# EAGLE design blink1mk3_005t6_3535_4l_usbc (EAGLE 9.5.2)
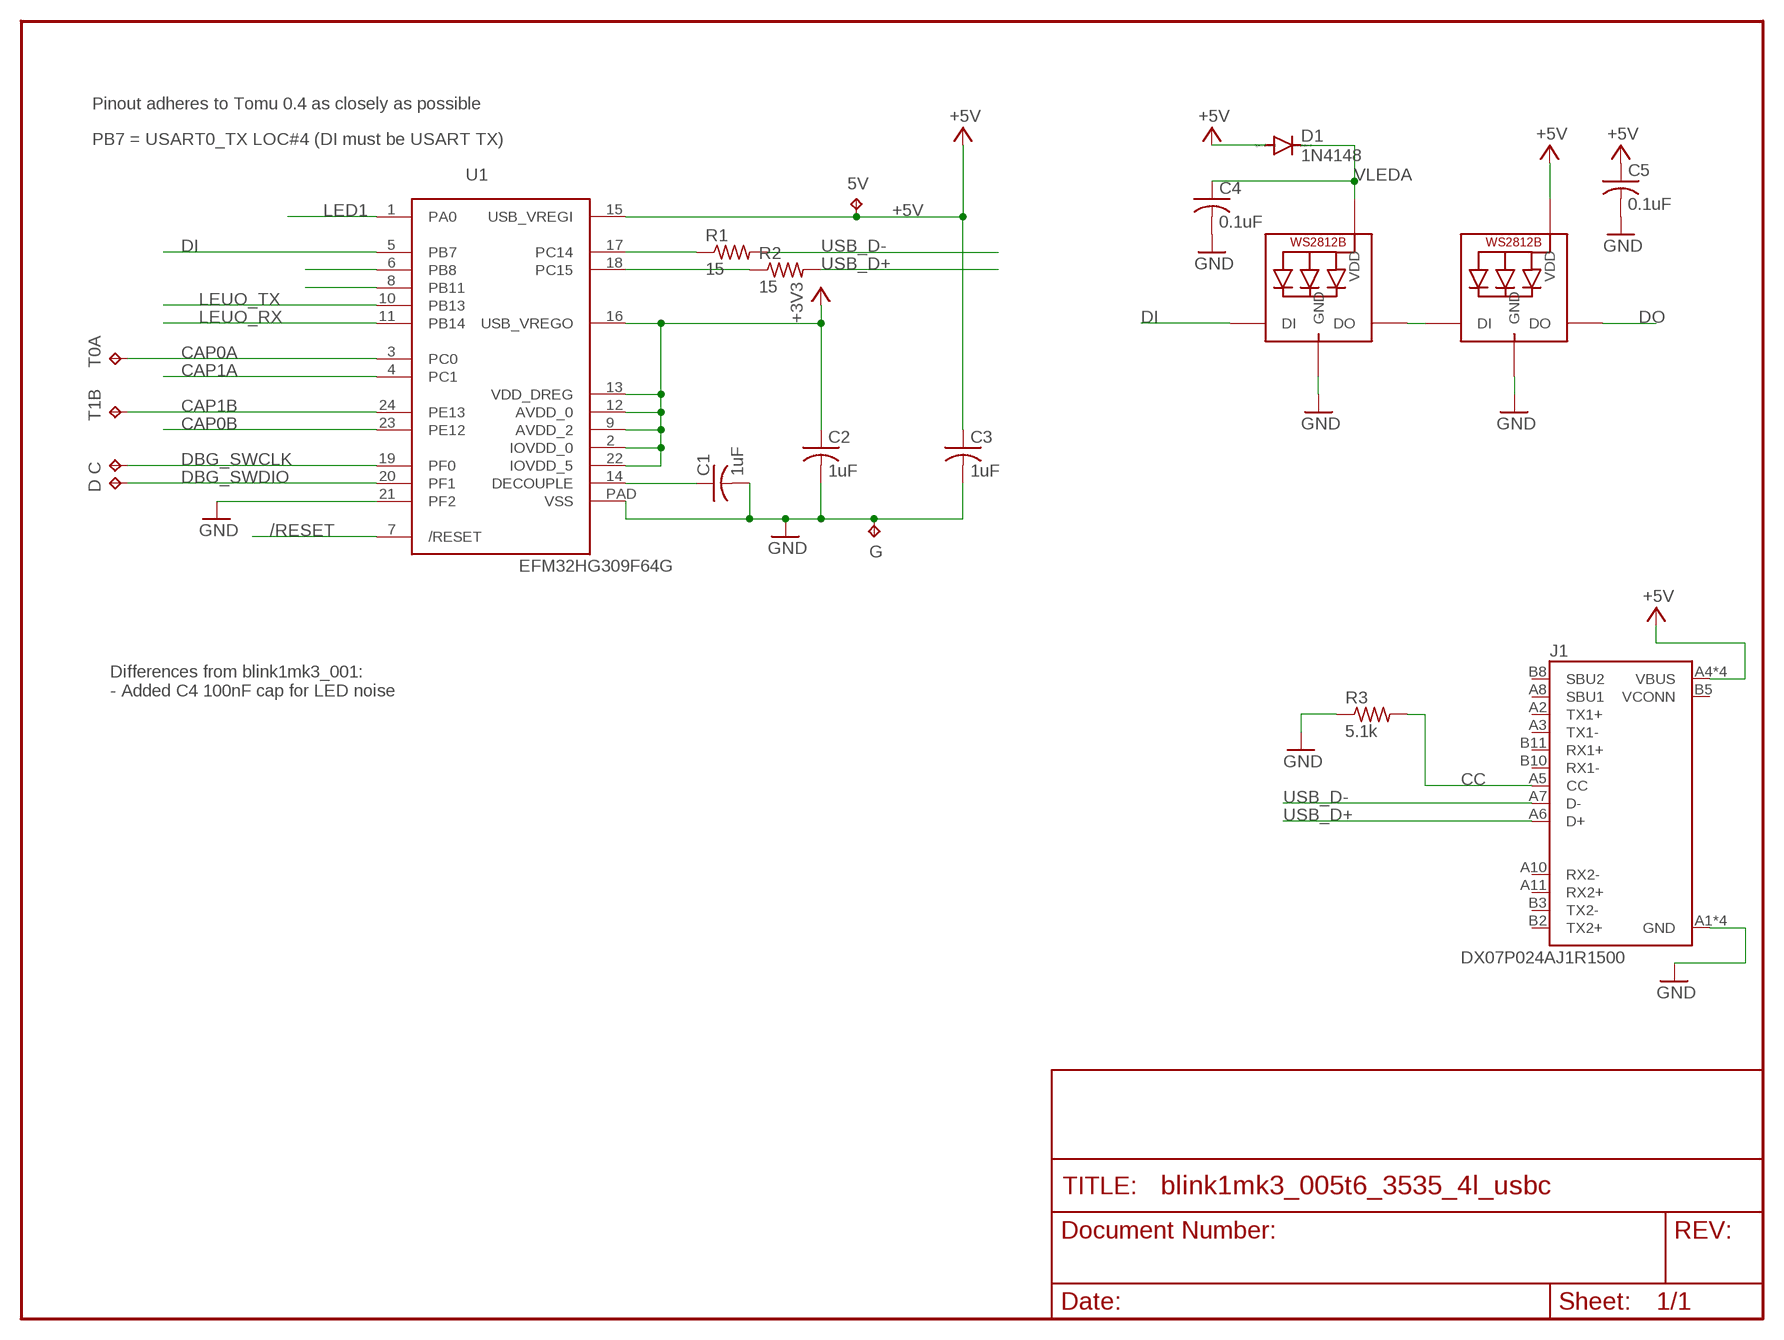
[diagram p0: schematic, sheet 1]

## Parts
5V  TPTP10R  [TP10R]
C  TPTP10R  [TP10R]
C1  1uF  C-USC0402  [C0402]
C2  1uF  C-USC0402  [C0402]
C3  1uF  C-USC0402  [C0402]
C4  0.1uF  C-USC0402  [C0402]
C5  0.1uF  C-USC0402  [C0402]
D  TPTP10R  [TP10R]
D1  1N4148  DIODE-SOD523  [SOD523]
G  TPTP10R  [TP10R]
J1  DX07P024AJ1R1500  [JAE_DX07P024AJ1R1500]
LED1  WS2812B3535  [LED3535]
LED2  SK6812MINI  WS2812B3535  [LED3535]
R1  15  R-US_R0402  [R0402]
R2  15  R-US_R0402  [R0402]
R3  5.1k  R-US_R0402  [R0402]
T0A  TPTP15R  [TP15R]
T1B  TPTP15R  [TP15R]
U1  EFM32HG309F64G  [QFN24PAD]

## Nets
+3V3: C2.1 U1.2(IOVDD_0) U1.9(AVDD_2) U1.12(AVDD_0) U1.13(VDD_DREG) U1.16(USB_VREGO) U1.22(IOVDD_5)
+5V: 5V.TP C3.1 C5.1 D1.A J1.A4(VBUS) J1.A9(VBUS) J1.B4(VBUS) J1.B9(VBUS) LED2.2(VDD) U1.15(USB_VREGI)
/RESET: U1.7(/RESET)
CAP0A: T0A.TP U1.3(PC0)
CAP0B: U1.23(PE12)
CAP1A: U1.4(PC1)
CAP1B: T1B.TP U1.24(PE13)
CC: J1.A5(CC) R3.2
DBG_SWCLK: C.TP U1.19(PF0)
DBG_SWDIO: D.TP U1.20(PF1)
DECOUPLE: C1.1 U1.14(DECOUPLE)
DI: LED1.1(DI) U1.5(PB7)
DO: LED2.3(DO)
GND: C1.2 C2.2 C3.2 C4.2 C5.2 G.TP J1.A1(GND) J1.A12(GND) J1.B1(GND) J1.B12(GND) LED1.4(GND) LED2.4(GND) R3.1 U1.21(PF2) U1.PAD(VSS)
LED1: U1.1(PA0)
LEUO_RX: U1.11(PB14)
LEUO_TX: U1.10(PB13)
N$1: U1.8(PB11)
N$2: LED1.3(DO) LED2.1(DI)
N$3: U1.6(PB8)
RUSB_D+: R2.1 U1.18(PC15)
RUSB_D-: R1.1 U1.17(PC14)
USB_D+: J1.A6(D+) R2.2
USB_D-: J1.A7(D-) R1.2
VLEDA: C4.1 D1.C LED1.2(VDD)
Unconnected: J1.A2(TX1+) J1.A3(TX1-) J1.A8(SBU1) J1.A10(RX2-) J1.A11(RX2+) J1.B2(TX2+) J1.B3(TX2-) J1.B8(SBU2) J1.B10(RX1-) J1.B11(RX1+)

## Notes on the sheet
- Pinout adheres to Tomu 0.4 as closely as possible
- PB7 = USART0_TX LOC#4 (DI must be USART TX)
- Differences from blink1mk3_001:
  - Added C4 100nF cap for LED noise

## Power pins joined to a net without a drawn wire
VCONN: J1.B5(VCONN)

## Library data of the parts
5V C D G T0A T1B = testpad:TP: Test pad
C1-C5 = rcl:C-US: CAPACITOR, American symbol; SPICEPREFIX: C
D1 = diode:DIODE-: DIODE
J1 = DX07P024AJ1R1500:DX07P024AJ1R1500: Cut Tape - Usb Type c Slim Plug; DESCRIPTION: Cut Tape - Usb Type c Slim Plug; DIGI-KEY_PART_NUMBER: 670-2868-1-ND; DIGI-KEY_PURCHASE_URL: https://www.digikey.com/product-detail/en/jae-electronics/DX07P024AJ1R1500/670-2868-1-ND/6003057?utm_source=snapeda&utm_medium=aggregator&utm_campaign=symbol; MF: JAE Electronics; MP: DX07P024AJ1R1500; PACKAGE: None
LED1 = todstuff:WS2812B
LED2 = adafruit:WS2812B
R1-R3 = rcl:R-US_: RESISTOR, American symbol; SPICEPREFIX: R
U1 = todstuff:EFM32HG309F64G

## Board
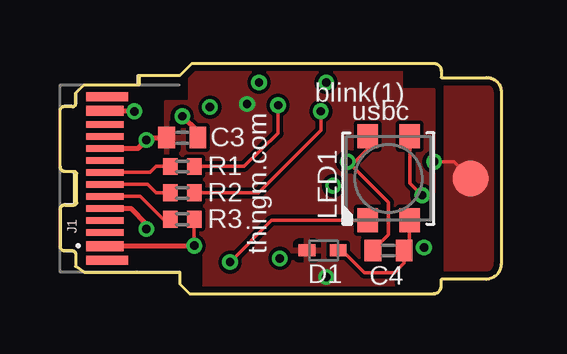
[diagram p1: board, top side]
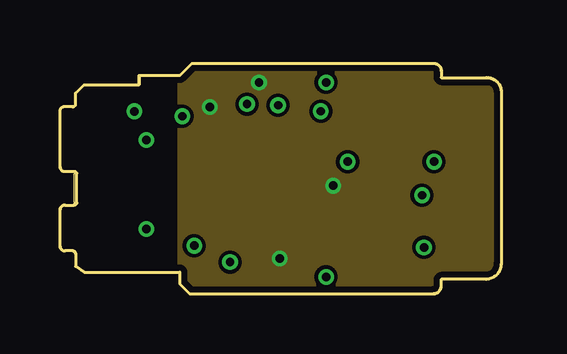
[diagram p2: board, inner layer Route2]
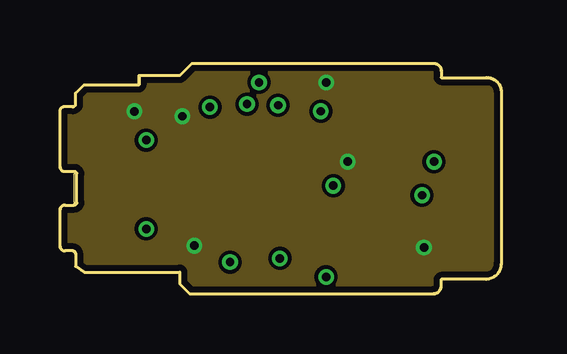
[diagram p3: board, inner layer Route15]
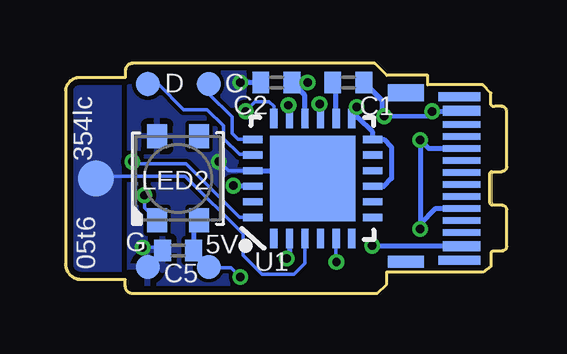
[diagram p4: board, bottom side, seen from below]

Size 18.4 x 9.6 mm. Coordinates in mm from the lower left corner, seen from the top.
Outline: 3.3,9.1 5,9.1 5.5,9.6 15.58,9.6 arc-90 15.9,9.28 15.9,9 17.76,9 arc-90 18.4,8.46 18.4,1.23 arc-90 17.76,0.6 15.9,0.6 15.9,0.32 arc-90 15.58,0 5.4,0 5,0.4 5,0.9 1,0.9 0.65,1.14 0.65,1.65 arc90 0.55,1.78 0.2,1.78 arc-90 0,1.98 0,3.49 arc-90 0.2,3.69 0.6,3.69 arc90 0.7,3.8 0.7,5 arc90 0.6,5.09 0.2,5.09 arc-90 0,5.29 0,7.6 arc-90 0.2,7.8 0.5,7.8 arc90 0.65,7.88 0.65,8.36 1,8.7 3.3,8.7 3.3,9.1
Copper layers (1+2*15+16): Top 0.035mm / dielectric 0.2mm / Route2 0.0175mm / dielectric 0.295mm / Route15 0.0175mm / dielectric 0.2mm / Bottom 0.035mm
Design rules "SeeedStudio_2layer_DRU_no_angle_20140221 *": minimum track width 6mil, minimum drill 12mil, track to track 6mil, track to pad 6mil, pad to pad 6mil, via to via 6mil, smd to smd 0mil, copper to edge 10mil, drill to drill 10mil, minimum pad ring 10mil, minimum via ring 6mil, stop-mask expansion 2mil, vias tented up to drill 100mil, thermal gap 10mil

### Footprints (pad centres in the part's own frame; a part is rotated, then mirrored left to right if it is on the bottom)
TP10R = smd 1 x 1: TP 0,0
C0402 = smd 0.7 x 0.9: 1 -0.65,0; 2 0.65,0
SOD523 = smd 0.7 x 0.5: A 0.7,0; C -0.6,0
JAE_DX07P024AJ1R1500 = smd 0.36 x 1.75: 13 -3.405,1.975; 14 3.405,1.975 | smd 0.36 x 1.75 bottom: 15 -3.405,1.975; 16 3.405,1.975 | smd 0.7 x 1.5 bottom: 17 -3.575,4.2 | smd 0.5 x 1.5 bottom: 18 3.475,4.2 | smd 0.41 x 1.55: A1 2.825,1.875; A12 -2.825,1.875 | smd 0.26 x 1.55: A2 2.25,1.875; A3 1.75,1.875; A4 1.25,1.875; A5 0.75,1.875; A6 0.25,1.875; A7 -0.25,1.875; A8 -0.75,1.875; A9 -1.25,1.875; A10 -1.75,1.875; A11 -2.25,1.875 | smd 0.41 x 1.55 bottom: B1 -2.825,1.875; B12 2.825,1.875 | smd 0.26 x 1.55 bottom: B2 -2.25,1.875; B3 -1.75,1.875; B4 -1.25,1.875; B5 -0.75,1.875; B6 -0.25,1.875; B7 0.25,1.875; B8 0.75,1.875; B9 1.25,1.875; B10 1.75,1.875; B11 2.25,1.875
LED3535 = smd 1 x 0.85: 1 -1.75,0.875; 2 -1.75,-0.875; 3 1.75,-0.875; 4 1.75,0.875
R0402 = smd 0.6 x 0.7: 1 -0.5,0; 2 0.5,0
TP15R = smd 1.5 x 1.5: TP 0,0
QFN24PAD = smd 0.8 x 0.3: 1 -2.5,1.625; 2 -2.5,0.975; 3 -2.5,0.325; 4 -2.5,-0.325; 5 -2.5,-0.975; 6 -2.5,-1.625; 13 2.5,-1.625; 14 2.5,-0.975; 15 2.5,-0.325; 16 2.5,0.325; 17 2.5,0.975; 18 2.5,1.625 | smd 0.3 x 0.8: 7 -1.625,-2.5; 8 -0.975,-2.5; 9 -0.325,-2.5; 10 0.325,-2.5; 11 0.975,-2.5; 12 1.625,-2.5; 19 1.625,2.5; 20 0.975,2.5; 21 0.325,2.5; 22 -0.325,2.5; 23 -0.975,2.5; 24 -1.625,2.5 | smd 3.55 x 3.55: PAD 0,0

### Placement (x,y rotation side)
5V  12.42,1.12 0 bottom
C  12.42,8.74 0 bottom
C1  6.6,8.8 0 bottom
C2  9.6,8.8 180 bottom
C3  5.1,6.5 0 top
C4  13.7,1.8 180 top
C5  13.7,1.8 180 bottom
D  14.96,8.74 0 bottom
D1  11,1.8 180 top
G  14.96,1.12 180 bottom
J1  0,4.8 270 top
LED1  13.7,4.8 90 top
LED2  13.7,4.8 90 bottom
R1  5.1,5.3 180 top
R2  5.1,4.2 180 top
R3  5.1,3.1 180 top
T0A  17.13,4.8 0 bottom
T1B  17.13,4.8 0 top
U1  8.08,4.8 90 bottom

### Tracks (layer width: path | path; a pad name or v marks a point on that pad's centre or on a via)
+3V3  (via drill 0.35)
  Bottom 0.2: v6.25,7.78 6.46,7.57 U1.13 | U1.16 8.41,8.26 C2.1 v8.3,8.8
  Bottom 0.203: U1.2 9.06,1.58 v9.17,1.47 | U1.22 11.38,4.47 v11.4,4.5 | U1.13 6.42,7.34 6.2,7.34 5.58,6.73 U1.12 5.12,6.42 4.8,6.1 4.8,4.8 5.12,4.47 U1.9
  pour Route2: 5,11.91 18.9,11.91 18.9,-2.69 5,-2.69
+5V  (via drill 0.35)
  Top 0.2: J1.A4 2.95,3.55 3.6,2.9 v3.6,2.7 | v3.6,6.4 3.7,6.5 C3.1
  Top 0.203: J1.A9 3.25,6.05 v3.6,6.4
  Bottom 0.152: 5V.TP 12.38,1.08 11.48,1.08 v11.1,0.7 | 2,3.55 J1.A4
  Bottom 0.2: 2,3.55 2.95,3.55 3.6,2.9 v3.6,2.7 v3.6,6.4 3.25,6.05 | U1.15 7.76,7.86 v7.8,7.9 | 5V.TP 12.42,1.17 C5.1 13.05,2.82 LED2.2
  Bottom 0.203: 3.25,6.05 J1.A9
  pour Top: 4.4,2.1 4.4,8 5.4,8 5.4,10.5 14.23,10.5 14.23,8.5 15.6,8.5 15.6,1.2 13.89,1.2 13.91,-0.4 6,-0.4 6,2.1
CAP0A
  Bottom 0.152: T0A.TP 17.03,4.9 13.4,4.9 11,2.5 11,1.6 10.2,0.8 8.87,0.8 8.41,1.26 U1.3
  pour Bottom (no thermals): 16.11,9.6 18.4,9.6 18.4,0.48 16.11,0.48
CAP1B  (via drill 0.35)
  Top 0.152: v15.6,5.5 16.43,5.5 T1B.TP
  Bottom 0.152: U1.24 11.14,3.17 13.37,5.4 15.5,5.4 v15.6,5.5
  pour Top (no thermals): 16.11,9.62 18.4,9.62 18.4,0.35 16.11,0.35
CC
  Top 0.152: J1.A5 3.35,4.05 4.3,3.1 R3.2
DBG_SWCLK
  Bottom 0.152: U1.19 11.21,6.42 11.46,6.68 11.46,7.37 12.42,8.33 C.TP
DBG_SWDIO
  Bottom 0.152: D.TP 14.54,8.74 13.47,7.67 12.48,7.67 11.81,7 11.81,6.47 11.15,5.8 10.61,5.8 U1.20
DECOUPLE
  Bottom 0.203: C1.1 7.11,8.66 U1.14
DI  (via drill 0.35)
  Top 0.152: v7.09,1.32 8.83,3.05 LED1.1
  Bottom 0.152: U1.5 7.11,1.32 v7.09,1.32
GND  (via drill 0.35)
  Top 0.152: C4.2 13.7,2.45 13.7,3.8 v12,5.5 12.3,5.5 12.82,6.03 LED1.4 | v5.6,2 R3.1
  Top 0.2: C3.2 5.75,6.75
  Top 0.203: J1.A12 3.07,7.62 v3.1,7.6 | v5.6,2 5.58,1.97 J1.B12 | 5.75,6.75 v5.1,7.39
  Bottom 0.152: U1.21 11.6,5.12 11.98,5.5 v12,5.5 | G.TP 14.35,1.73 C5.2 14.48,1.93 v15.18,1.93
  Bottom 0.2: C1.2 5.2,8.05 5.2,7.39 | v11.1,8.8 C2.2
  Bottom 0.203: U1.21 8.41,5.12 U1.PAD | J1.A12 1.9,7.6 v3.1,7.6 v3.1,7.59 3.29,7.4 v5.1,7.39 | J1.B12 5.58,1.97 v5.6,2 | v5.1,7.39 | 5.2,7.39 v5.1,7.39
  pour Bottom: 10.82,10.16 10.82,-0.63 15.73,-0.63 15.73,10.16
  pour Route15: -0.31,11.91 18.77,11.91 18.77,-2.82 -0.31,-2.82
N$2  (via drill 0.35)
  Top 0.152: v15.1,4.1 14.6,4.6 14.6,5.8 14.6,6.53 LED1.3
  Bottom 0.152: v15.1,4.1 15.1,3.57 LED2.1
RUSB_D+  (via drill 0.35)
  Top 0.152: v10.88,7.6 10.88,6.8 8.28,4.2 R2.1
  Bottom 0.152: U1.18 9.71,7.81 9.9,8 10.48,8 v10.88,7.6
RUSB_D-  (via drill 0.35)
  Top 0.152: R1.1 7.67,5.3 9.1,6.68 v9.1,7.85
  Bottom 0.152: U1.17 9.06,7.81 v9.1,7.85
USB_D+
  Top 0.152: R2.2 4,4.2 3.65,4.55 J1.A6
USB_D-
  Top 0.152: R1.2 4,5.3 3.75,5.05 J1.A7
VLEDA
  Top 0.152: D1.C 11.75,1.8 12.69,0.86 13.95,0.86 14.35,1.26 C4.1 14.57,2.02 LED1.2

### Text on the board
tPlace: blink(1) | usbc | thingm.com
bPlace: 354lc | 05t6